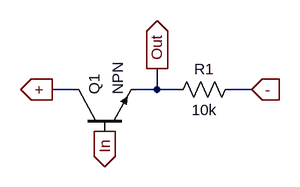
[diagram p0: schematic Buffer.asc]
Buffer.asc, the LTspice schematic file:
Version 4
SHEET 1 880 680
WIRE 48 112 16 112
WIRE 176 112 176 80
WIRE 176 112 144 112
WIRE 208 112 176 112
WIRE 320 112 288 112
FLAG 176 80 Out
IOPIN 176 80 Out
FLAG 16 112 +
IOPIN 16 112 Out
FLAG 96 176 In
IOPIN 96 176 Out
FLAG 320 112 -
IOPIN 320 112 In
SYMBOL npn 48 176 R270
SYMATTR InstName Q1
SYMBOL res 304 96 R90
WINDOW 0 0 56 VBottom 2
WINDOW 3 32 56 VTop 2
SYMATTR InstName R1
SYMATTR Value 10k

The netlist it stands for:
* Buffer.asc
Q1 + In Out 0 NPN
R1 - Out 10k
.model NPN NPN
.model PNP PNP
.lib standard.bjt
.backanno
.end